# EAGLE design klaboard_schema (EAGLE 7.1.0)
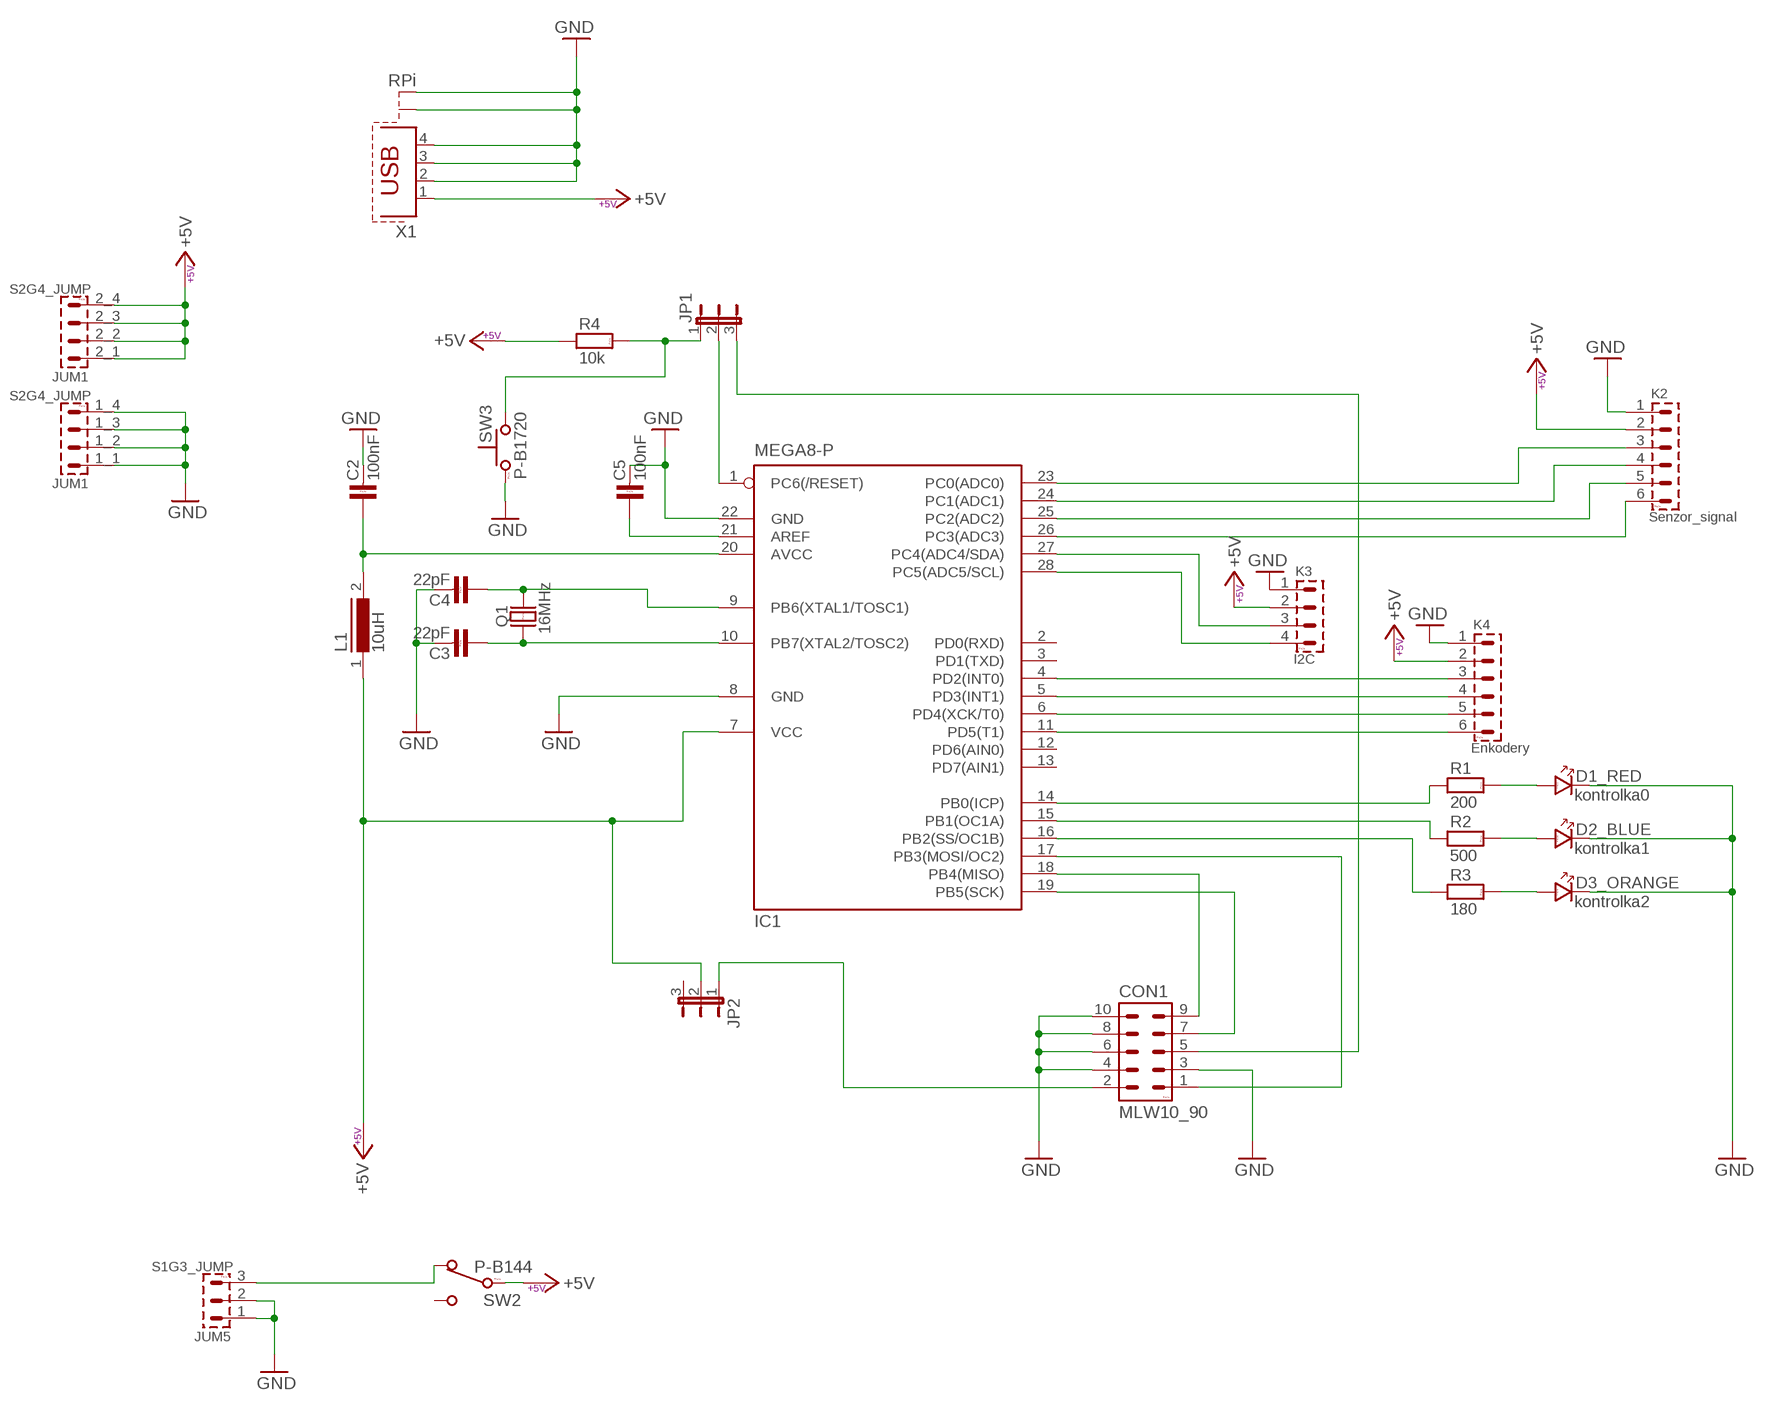
[diagram p0: schematic, sheet 1]

## Parts
C2  100nF  C-KER_7,5  [C-7,5]
C3  22pF  C-KER_7,5  [C-7,5]
C4  22pF  C-KER_7,5  [C-7,5]
C5  100nF  C-KER_7,5  [C-7,5]
CON1  MLW10_90  MLW10_90°  [MLW10A]
D1_RED  kontrolka0  LED_3  [LED_3]
D2_BLUE  kontrolka1  LED_3  [LED_3]
D3_ORANGE  kontrolka2  LED_3  [LED_3]
IC1  MEGA8-P  [DIL28-3]
JP1  JP2E  [JP2]
JP2  JP2E  [JP2]
JUM1  S2G4_JUMP  [S2G4_JUM]
JUM5  S1G3_JUMP  [S1G3_JUM]
K2  Senzor_signal  PSH02-06W  [PSH02-06W]
K3  I2C  PSH02-04W  [PSH02-04W]
K4  Enkodery  PSH02-06W  [PSH02-06W]
L1  10uH  SBC10  [SBC10]
Q1  16MHz  Q_HC-49U  [HC-49U]
R1  200  R_12,7  [R-12,7]
R2  500  R_12,7  [R-12,7]
R3  180  R_12,7  [R-12,7]
R4  10k  R_12,7  [R-12,7]
SW2  P-B144  [P-B144]
SW3  P-B1720  [P-B1720]
X1  RPi  PN61729-S  [PN61729-S]

## Nets
+5V: IC1.7(VCC) JP2.2 JUM1.2_1 JUM1.2_2 JUM1.2_3 JUM1.2_4 K2.2 K3.2 K4.2 L1.1 R4.1 SW2.2(2-COM) X1.1
GND: C2.2 C3.2 C4.2 C5.2 CON1.3 CON1.4 CON1.6 CON1.8 CON1.10 D1_RED.K D2_BLUE.K D3_ORANGE.K IC1.8(GND) IC1.22(GND) JUM1.1_1 JUM1.1_2 JUM1.1_3 JUM1.1_4 JUM5.1 JUM5.2 K2.1 K3.1 K4.1 SW3.1 X1.2 X1.3 X1.4 X1.S1 X1.S2
N$1: IC1.28(PC5(ADC5/SCL)) K3.4
N$2: C2.1 IC1.20(AVCC) L1.2
N$3: IC1.4(PD2(INT0)) K4.3
N$4: IC1.5(PD3(INT1)) K4.4
N$5: IC1.6(PD4(XCK/T0)) K4.5
N$6: IC1.11(PD5(T1)) K4.6
N$7: C3.1 IC1.10(PB7(XTAL2/TOSC2)) Q1.1
N$8: C4.1 IC1.9(PB6(XTAL1/TOSC1)) Q1.2
N$9: C5.1 IC1.21(AREF)
N$10: IC1.14(PB0(ICP)) R1.1
N$11: IC1.27(PC4(ADC4/SDA)) K3.3
N$12: CON1.1 IC1.17(PB3(MOSI/OC2))
N$13: CON1.2 JP2.1
N$14: IC1.1(PC6(/RESET)) JP1.2
N$15: JUM5.3 SW2.3(3-NC)
N$16: CON1.7 IC1.19(PB5(SCK))
N$17: CON1.9 IC1.18(PB4(MISO))
N$18: IC1.15(PB1(OC1A)) R2.1
N$19: IC1.16(PB2(SS/OC1B)) R3.1
N$20: D3_ORANGE.A R3.2
N$21: D2_BLUE.A R2.2
N$22: D1_RED.A R1.2
N$23: IC1.26(PC3(ADC3)) K2.6
N$24: IC1.25(PC2(ADC2)) K2.5
N$25: IC1.24(PC1(ADC1)) K2.4
N$26: IC1.23(PC0(ADC0)) K2.3
N$31: JP1.1 R4.2 SW3.2
N$33: CON1.5 JP1.3
Unconnected: IC1.2(PD0(RXD)) IC1.3(PD1(TXD)) IC1.12(PD6(AIN0)) IC1.13(PD7(AIN1)) JP2.3 SW2.1(1-NO) SW3.3(1A) SW3.4(2A)

## Library data of the parts
C2-C5 = #PaJa_31:C-KER: Kondenzator - keramicky
CON1 = #PaJa_konektory:MLW10: Konektory MLW - vidlice - 10x
D1_RED D2_BLUE D3_ORANGE = #PaJa_31:LED: LED - jednobarevna
IC1 = atmel:MEGA8-P: MICROCONTROLLER 8 Kbytes FLASH, 1 kbytes SRAM, 512 bytes EEPROM, USART, 4-channel 10 bit ADC, 2-channel 8 bit ADC Pin compatible with Atmega48, ATMega88, ATMega168 Source: avr.lbr; OC_FARNELL: unknown; OC_NEWARK: unknown
JP1 JP2 = jumper:JP2E: JUMPER
JUM1 = #PaJa_konektory:S2G4_JUMP: Radove konektory - koliky - dvojite - 2x4
JUM5 = #PaJa_konektory:S1G3_JUMP: Radove konektory - koliky - 3x
K2 K4 = #PaJa_konektory:PSH02-06: Konektory se zamkem - vidlice - 6pin
K3 = #PaJa_konektory:PSH02-04: Konektory se zamkem - vidlice - 4pin
L1 = inductors:SBC10: INDUCTOR
Q1 = #PaJa_31:Q: Krystal HC-49 - 1MHz - 48MHz DT38 - Quartz (hodinovy) 32,768kHz
R1-R4 = #PaJa_31:R: Rezistor
SW2 = #PaJa_prepinace:P-B144: Posuvny prepinac
SW3 = #PaJa_prepinace:P-B1720: µ-tlacitko
X1 = con-berg:PN61729-S: BERG USB connector; OC_FARNELL: unknown; OC_NEWARK: unknown

## Board
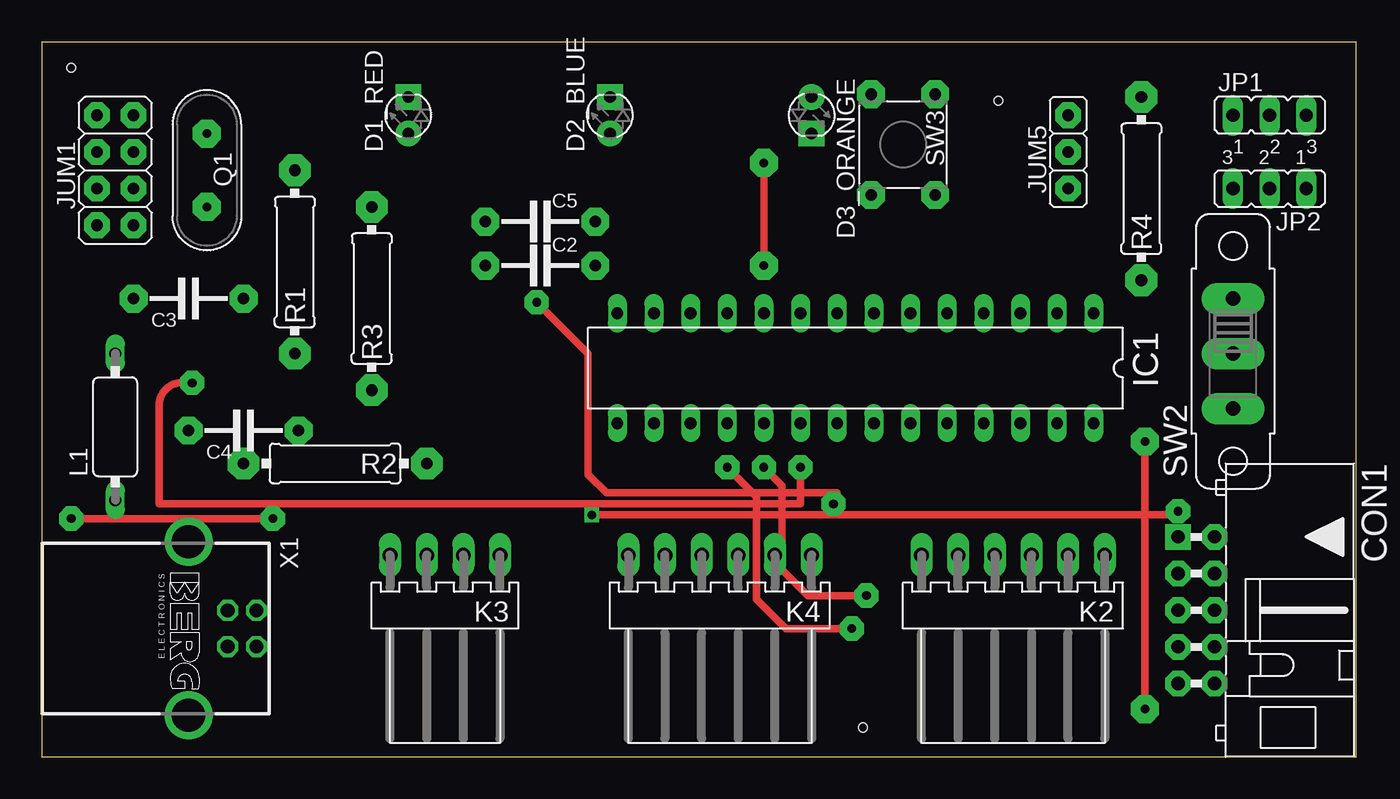
[diagram p1: board, top side]
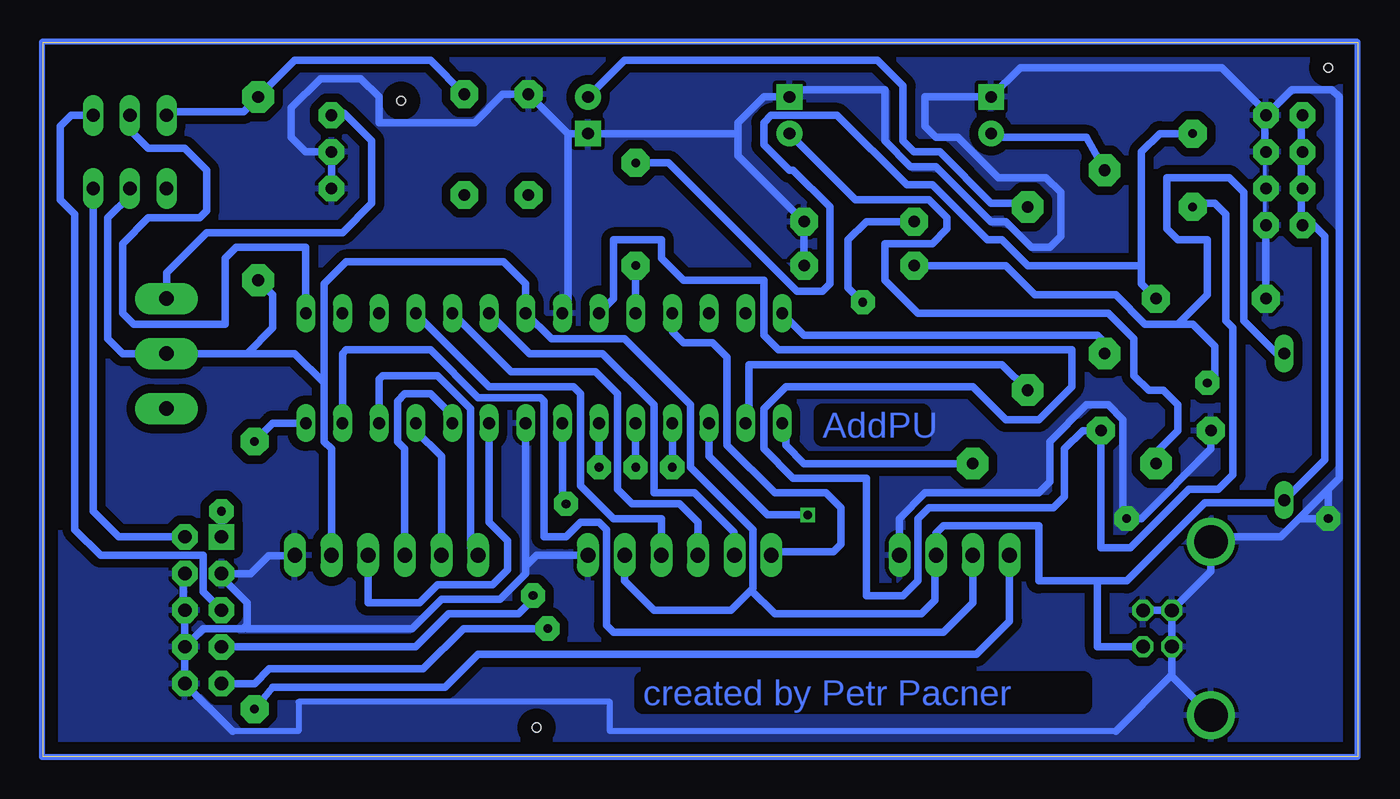
[diagram p2: board, bottom side, seen from below]

Size 91.11 x 49.52 mm. Coordinates in mm from the lower left corner, seen from the top.
Outline: 0,0 91.11,0 91.11,49.52 0,49.52 0,0
Copper layers (1*16): Top 0.035mm / dielectric 1.5mm / Bottom 0.035mm
Design rules "default": minimum track width 10mil, minimum drill 24mil, track to track 8mil, track to pad 8mil, pad to pad 8mil, via to via 8mil, smd to smd 8mil, copper to edge 40mil, drill to drill 8mil, minimum pad ring 10mil, minimum via ring 8mil, stop-mask expansion 4mil, vias tented up to drill 0mil, thermal gap 10mil
Holes 0.6 mm at 2.03,47.75 56.9,2.03 66.29,45.47

### Footprints (pad centres in the part's own frame; a part is rotated, then mirrored left to right if it is on the bottom)
C-7,5 = drill 0.813 pad 1.93 octagon: 1 -3.81,0; 2 3.81,0
MLW10A = drill 0.914 pad 1.778 square: 1 -5.08,-1.27 | drill 0.914 pad 1.778 octagon: 2 -5.08,1.27; 3 -2.54,-1.27; 4 -2.54,1.27; 5 0,-1.27; 6 0,1.27; 7 2.54,-1.27; 8 2.54,1.27; 9 5.08,-1.27; 10 5.08,1.27
LED_3 = drill 0.813 pad 1.778: A -1.27,0 | drill 0.813 pad 1.778 square: K 1.27,0
DIL28-3 = drill 0.813 long: 1 -16.51,-3.81; 2 -13.97,-3.81; 3 -11.43,-3.81; 4 -8.89,-3.81; 5 -6.35,-3.81; 6 -3.81,-3.81; 7 -1.27,-3.81; 8 1.27,-3.81; 9 3.81,-3.81; 10 6.35,-3.81; 11 8.89,-3.81; 12 11.43,-3.81; 13 13.97,-3.81; 14 16.51,-3.81; 15 16.51,3.81; 16 13.97,3.81; 17 11.43,3.81; 18 8.89,3.81; 19 6.35,3.81; 20 3.81,3.81; 21 1.27,3.81; 22 -1.27,3.81; 23 -3.81,3.81; 24 -6.35,3.81; 25 -8.89,3.81; 26 -11.43,3.81; 27 -13.97,3.81; 28 -16.51,3.81
JP2 = drill 0.914 long: 1 -2.54,0; 2 0,0; 3 2.54,0
S2G4_JUM = drill 0.813 pad 1.778 octagon: 1_1 -3.81,-1.27; 1_2 -1.27,-1.27; 1_3 1.27,-1.27; 1_4 3.81,-1.27; 2_1 -3.81,1.27; 2_2 -1.27,1.27; 2_3 1.27,1.27; 2_4 3.81,1.27
S1G3_JUM = drill 0.813 pad 1.778 octagon: 1 -2.54,0; 2 0,0; 3 2.54,0
PSH02-06W = drill 1.016 pad 1.422 long: 1 -6.35,0; 2 -3.81,0; 3 -1.27,0; 4 1.27,0; 5 3.81,0; 6 6.35,0
PSH02-04W = drill 1.016 pad 1.422 long: 1 -3.81,0; 2 -1.27,0; 3 1.27,0; 4 3.81,0
SBC10 = drill 0.813 long: 1 -5.08,0; 2 5.08,0
HC-49U = drill 0.61 pad 1.93 octagon: 1 -2.54,0; 2 2.54,0
R-12,7 = drill 0.813 pad 2.184 octagon: 1 -6.35,0; 2 6.35,0
P-B144 = drill 1.016 pad 2.184 long: 1 -3.81,0; 2 0,0; 3 3.81,0
P-B1720 = drill 0.813 pad 1.93 octagon: 1 -3.493,-2.223; 2 -3.493,2.223; 3 3.493,-2.223; 4 3.493,2.223
PN61729-S = drill 0.95 octagon: 1 1.25,4.71; 2 -1.25,4.71; 3 -1.25,2.71; 4 1.25,2.71 | drill 2.3 pad 2.9: S1 -6.02,0; S2 6.02,0

### Placement (x,y rotation side)
C2  34.54,34.04 0 top
C3  22picoF  [C-7,5]  10.16,31.75 180 top
C4  22picoF  [C-7,5]  13.97,22.61 180 top
C5  34.54,37.08 0 top
CON1  80.01,10.16 270 top
D1_RED  ERROR  [LED_3]  25.4,44.45 90 top
D2_BLUE  TWI-in_progress  [LED_3]  39.37,44.45 90 top
D3_ORANGE  Program_ready  [LED_3]  53.34,44.45 270 top
IC1  56.39,26.92 180 top
JP1  85.09,44.45 0 top
JP2  85.09,39.37 180 top
JUM1  5.08,40.64 90 top
JUM5  71.12,41.91 90 top
K2  Sensor_signal  [PSH02-06W]  67.31,13.97 180 top
K3  27.94,13.97 180 top
K4  46.99,13.97 180 top
L1  10microH  [SBC10]  5.08,22.86 90 top
Q1  11.43,40.64 270 top
R1  17.53,34.29 90 top
R2  100  [R-12,7]  20.32,20.32 180 top
R3  22.86,31.75 90 top
R4  76.2,39.37 90 top
SW2  82.55,27.94 90 top
SW3  59.69,42.42 270 top
X1  10.16,8.89 270 top

### Tracks (layer width: path | path; a pad name or v marks a point on that pad's centre or on a via)
+5V
  Bottom 0.254: 85.06,39.32 JP2.2 | 3.91,37.03 JUM1.2_1 3.91,36.8 | 3.91,39.32 JUM1.2_2 3.91,39.55 | 3.91,42.06 JUM1.2_3 3.91,41.83 | 3.91,44.35 JUM1.2_4 | 5.28,17.6 L1.1 5.05,17.83 3.91,18.97 | 29.06,14.17 K3.2 29.29,13.95
  Bottom 0.305: 41.91,11.68 42.04,11.56
  Bottom 0.508: 3.91,44.35 3.91,42.01 JUM1.2_3 | 3.91,39.32 3.91,36.93 JUM1.2_1 3.05,36.83 2.29,36.07 2.29,20.57 L1.1 | 3.91,41.83 3.91,39.47 JUM1.2_2 | 5.28,17.6 10.59,17.6 16,12.19 18.03,12.19 | X1.1 14.89,7.62 18.03,7.62 18.03,12.19 | 18.03,12.19 22.1,12.19 22.1,16 28.7,16 29.21,15.49 K3.2 | 85.06,39.32 85.06,38.89 86.61,37.34 86.61,28.96 85.6,27.94 SW2.2 76.96,27.94 | R4.1 75.18,32 75.18,29.72 76.96,27.94 | K2.2 71.12,21.34 71.63,21.84 71.63,25.91 | 41.91,11.68 41.91,15.75 46.23,20.07 46.23,24.38 50.8,28.96 55.88,28.96 IC1.7 57.66,32.77 59.18,34.29 70.1,34.29 71.63,32.77 71.63,25.91 | 76.96,27.94 73.66,27.94 71.63,25.91 | 29.29,13.95 29.29,10.85 30.23,9.91 40.39,9.91 42.04,11.56 43.43,10.16 48.77,10.16 50.8,12.19 K4.2
GND  (via drill 0.6 pad 1.68)
  Top 0.508: v16,16.51 v2.03,16.51
  Bottom 0.254: 53.29,14.17 K4.1 | 71.12,39.32 JUM5.1 | 78.66,12.8 CON1.3 | 81.41,10.29 CON1.6 | 6.43,42.06 JUM1.1_3 6.43,41.83 6.43,39.55 JUM1.1_2 6.43,39.32 6.43,37.03 JUM1.1_1 6.43,36.8 | 6.43,44.35 JUM1.1_4 | 6.43,44.58 JUM1.1_4 | 10.08,15.09 X1.S1 | 6.2,44.58 JUM1.1_4 | 80.49,5.03 81.18,5.03 CON1.10
  Bottom 0.406: 16.76,1.78 51.82,1.78 51.82,3.81 73.41,3.81 73.41,1.78 77.98,1.78
  Bottom 0.508: JUM1.1_4 6.35,44.7 9.4,47.75 23.37,47.75 D1_RED.K 29.97,45.72 29.97,43.69 29.21,42.93 27.69,42.93 24.89,40.13 21.59,40.13 20.57,39.12 20.57,36.07 21.34,35.31 22.61,35.31 24.38,37.08 25.4,37.08 29.21,40.89 30.99,40.89 32.77,42.67 32.77,46.23 38.86,46.23 D2_BLUE.K 41.15,45.72 42.93,43.94 42.93,43.18 | 6.2,44.58 4.55,46.23 1.78,46.23 1.27,45.72 1.27,19.3 2.03,18.54 | 2.03,18.54 4.06,16.51 | 9.83,15.24 5.33,15.24 4.06,16.51 | 9.83,15.24 X1.S1 | X1.S1 10.16,12.85 X1.3 | X1.3 X1.2 | X1.3 X1.4 12.87,5.58 | 12.87,5.58 X1.S2 | C2.2 C5.2 42.93,41.66 42.93,43.18 | 6.43,44.35 6.43,41.99 JUM1.1_3 | C3.2 JUM1.1_1 | K3.1 31.75,16.51 29.97,18.29 22.1,18.29 21.34,19.05 21.34,21.84 18.8,24.38 17.27,24.38 16.26,23.37 16.26,16.51 v16,16.51 14.99,16.51 10.16,21.34 C4.2 | JUM5.1 JUM5.2 72.9,41.91 73.91,42.93 73.91,44.96 71.88,46.99 69.09,46.99 67.82,45.72 67.82,43.94 61.21,43.94 59.25,45.91 SW3.1 54.74,43.18 | CON1.8 CON1.6 | 81.41,10.29 81.41,12.57 CON1.4 | 77.09,9.02 76.96,9.14 76.96,10.67 78.74,12.45 CON1.3 76.71,12.7 75.46,13.95 73.69,13.95 K2.1 | 77.09,9.02 77.22,8.89 80.01,8.89 CON1.8 | CON1.8 CON1.10 77.98,1.78 | 54.74,43.18 D3_ORANGE.K 42.93,43.18 | 54.74,43.18 54.74,31.11 IC1.8 | 53.29,14.17 53.29,15.19 | IC1.22 57.66,13.21 | 57.66,13.21 57.66,12.7 59.44,10.92 63.5,10.92 65.53,8.89 76.96,8.89 77.09,9.02 | K4.1 56.9,13.97 57.66,13.21 | 12.87,5.58 12.96,5.58 16.76,1.78 | 2.03,18.54 v2.03,16.51 4.06,16.51 | X1.S1 10.16,14.99 9.91,15.24 9.83,15.24
  pour Bottom (isolate 0.61): 0,49.53 91.19,49.53 91.19,0 0,0
N$1  (via drill 0.6 pad 1.93)
  Top 0.508: v76.45,21.84 v76.45,3.3
  Bottom 0.508: IC1.28 75.18,23.11 v76.45,21.84 | v76.45,3.3 75.18,4.83 63.25,4.83 60.96,7.11 26.42,7.11 24.13,9.4 K3.4
N$2  (via drill 0.6 pad 1.68)  (1 unrouted)
  Top 0.508: 52.58,20.07 52.58,17.53 8.13,17.53 8.13,24.38 arc-90 9.65,25.91 v10.41,25.91
  Bottom 0.508: L1.2 5.59,27.94 7.87,30.23 7.87,39.12 8.89,40.13 13.21,40.13 13.21,36.58 12.45,35.81 10.41,35.81 10.41,32 12.45,29.97 | 12.45,29.97 11.43,29.97 9.91,28.45 9.91,26.42 v10.41,25.91 | IC1.20 52.58,20.07 | C2.1 24.38,34.04 22.35,32 16.76,32 14.73,29.97 12.45,29.97
N$3
  Bottom 0.508: K4.3 48.26,16.51 51.56,16.51 53.85,18.8 53.85,25.15 54.36,25.65 60.2,25.65 IC1.4
N$4
  Bottom 0.508: K4.4 45.72,16.26 46.99,17.53 50.29,17.53 51.31,18.54 51.31,25.15 52.83,26.67 58.67,26.67 IC1.5
N$5
  Bottom 0.254: 43.23,14.17 K4.5
  Bottom 0.508: 43.23,14.17 43.23,15.54 45.97,18.29 48.77,18.29 48.77,24.38 52.32,27.94 57.4,27.94 IC1.6
N$6
  Bottom 0.508: IC1.11 47.5,29.46 46.74,28.7 44.7,28.7 43.69,27.69 43.69,21.59 40.39,18.29 36.83,18.29 35.81,17.27 35.81,14.73 36.32,14.22 40.39,14.22 K4.6
N$7  (via drill 0.6 pad 1.93)
  Top 0.508: v50.04,41.15 v50.04,34.04
  Bottom 0.254: 50.55,30.63 50.09,30.63 IC1.10
  Bottom 0.508: C3.1 14.99,32.77 14.99,34.04 | 14.99,34.04 14.99,41.91 13.72,43.18 Q1.1 | IC1.10 v50.04,34.04 | 14.99,34.04 22.86,34.04 24.64,35.81 25.65,35.81 29.46,39.62 31.24,39.62 36.07,44.45 40.64,44.45 41.15,43.94 41.15,42.42 39.37,40.64 39.12,40.64 36.58,38.1 36.58,32.77 37.08,32.26 38.86,32.26 47.75,41.15 v50.04,41.15
N$8
  Bottom 0.508: Q1.2 11.18,38.35 9.91,38.35 9.14,37.59 9.14,30.23 8.64,29.72 8.64,19.56 9.65,18.54 11.68,18.54 15.75,14.48 17.78,14.48 C4.1 19.05,22.61 20.32,21.34 20.32,18.03 21.08,17.27 29.72,17.27 30.48,16.51 30.48,12.19 31.5,11.18 34.04,11.18 34.04,19.3 39.12,19.3 41.15,21.34 41.15,24.13 39.62,25.65 26.67,25.65 24.38,23.37 22.1,23.37 19.81,25.65 19.81,28.19 40.13,28.19 41.15,29.21 41.15,33.02 46.74,33.02 48.26,34.54 48.26,35.81 51.56,35.81 51.56,31.75 IC1.9
N$9  (via drill 0.6 pad 1.68)  (1 unrouted)
  Top 0.508: v34.29,31.5 37.85,27.94 37.85,19.56 39.12,18.29 55.12,18.29 54.99,18.16 54.99,17.65 54.86,17.53
  Bottom 0.508: IC1.21 55.12,17.78 54.86,17.53 | C5.1 34.04,37.08 35.31,35.81 35.31,32.51 v34.29,31.5
N$10
  Bottom 0.508: R1.1 17.53,28.7 18.03,29.21 38.35,29.21 IC1.14
N$11
  Bottom 0.254: 70.21,23.32 IC1.27
  Bottom 0.508: IC1.27 70.36,27.94 70.1,28.19 64.26,28.19 60.96,24.89 56.64,24.89 56.39,24.64 56.39,15.24 54.86,15.24 53.85,16.26 52.58,16.26 52.06,15.73 52.06,9.13 51.56,8.64 28.7,8.64 26.67,10.67 K3.3
N$12  (via drill 0.6, 0.6 pad 1.68)
  Top 0.508: v38.1,16.76 78.74,16.76 v78.74,17.02
  Bottom 0.508: CON1.1 v78.74,17.02 | IC1.17 44.96,20.83 40.89,16.76 v38.1,16.76
N$13
  Bottom 0.508: JP2.1 87.63,17.02 85.85,15.24 CON1.2
N$14
  Bottom 0.508: JP1.2 85.09,43.43 83.82,42.16 81.28,42.16 79.76,40.64 79.76,37.85 80.26,37.34 83.82,37.34 85.6,35.56 85.6,30.73 84.84,29.97 78.49,29.97 78.49,34.54 77.72,35.31 72.9,35.31 IC1.1
N$15
  Bottom 0.254: 71.12,44.58 JUM5.3
  Bottom 0.508: 71.12,44.58 70.23,44.58 68.33,42.67 68.33,38.35 70.36,36.32 79.76,36.32 82.55,33.53 SW2.3
N$16  (via drill 0.6 pad 1.68)  (1 unrouted)
  Top 0.508: v50.04,20.07 51.31,18.8 51.31,12.95 53.09,11.18 57.15,11.18
  Bottom 0.508: IC1.19 v50.04,20.07 | 57.15,11.18 57.15,10.92 58.17,9.91 62.99,9.91 65.28,7.62 CON1.7
N$17  (via drill 0.6 pad 1.68)  (1 unrouted)
  Top 0.508: v47.5,20.07 49.53,18.03 49.53,10.92 51.56,8.89 56.13,8.89
  Bottom 0.508: IC1.18 v47.5,20.07 | 56.13,8.89 61.98,8.89 64.77,6.1 75.44,6.1 76.45,5.08 CON1.9
N$18
  Bottom 0.508: R2.1 38.35,20.32 39.62,21.59 39.62,22.86 IC1.15
N$19
  Bottom 0.508: IC1.16 42.16,23.37 42.16,27.18 24.64,27.18 R3.1
N$20
  Bottom 0.508: R3.2 23.11,38.1 23.11,38.35 25.4,38.35 28.96,41.91 30.73,41.91 31.5,42.67 31.5,46.48 33.27,48.26 50.8,48.26 D3_ORANGE.A
N$21
  Bottom 0.508: R2.2 13.97,21.08 12.45,22.61 12.45,24.38 13.46,25.4 14.48,25.4 15.49,26.42 15.49,28.96 17.27,30.73 30.48,30.73 32.77,33.02 32.77,35.56 29.46,35.56 28.45,36.58 28.45,37.34 29.72,38.61 34.8,38.61 D2_BLUE.A
N$22
  Bottom 0.508: R1.2 18.8,42.93 24.89,42.93 25.15,43.18 D1_RED.A
N$23
  Bottom 0.254: 61.29,14.4 61.06,14.17 K2.6
  Bottom 0.508: K2.6 61.47,14.48 61.47,24.13 63.75,26.42 67.56,26.42 67.82,26.16 IC1.26
N$24
  Bottom 0.508: IC1.25 65.28,22.61 63.5,20.83 K2.5
N$25
  Bottom 0.508: K2.4 66.04,21.34 66.55,21.84 66.55,24.64 66.04,25.15 64.26,25.15 62.74,23.62 IC1.24
N$26
  Bottom 0.508: K2.3 68.58,10.67 65.02,10.67 63.75,11.94 59.94,11.94 58.93,12.95 58.93,14.99 60.2,16.26 IC1.23
N$27  (via drill 0.6 pad 1.68)
  other vias: 57.15,11.18
N$28  (via drill 0.6 pad 1.68)
  other vias: 56.13,8.89
N$29  (via drill 0.6 pad 1.68)
  other vias: 54.86,17.53
N$30  (via drill 0.6 pad 1.68)
  other vias: 52.58,20.07
N$31
  Bottom 0.254: 82.55,44.58 JP1.1 | 76.38,45.72 R4.2 76.15,45.72
  Bottom 0.508: SW3.2 64.26,48.26 73.66,48.26 R4.2 | 76.38,45.72 76.38,45.54 77.22,44.7 82.3,44.7 JP1.1
N$33
  Bottom 0.508: CON1.5 80.01,11.43 80.01,13.97 87.12,13.97 88.9,15.75 88.9,37.59 89.92,38.61 89.92,43.69 89.15,44.45 JP1.3
S$1
  Bottom 0.406: 0,49.53 91.19,49.53 91.19,0 0,0 0,49.53

### Text on the board
Bottom: AddPU | created by Petr Pacner